# Altium schematic sheet 07-LogicXOR.SchDoc
size A4; DocumentNumber: 7; SheetNumber: 7; SheetTotal: 26
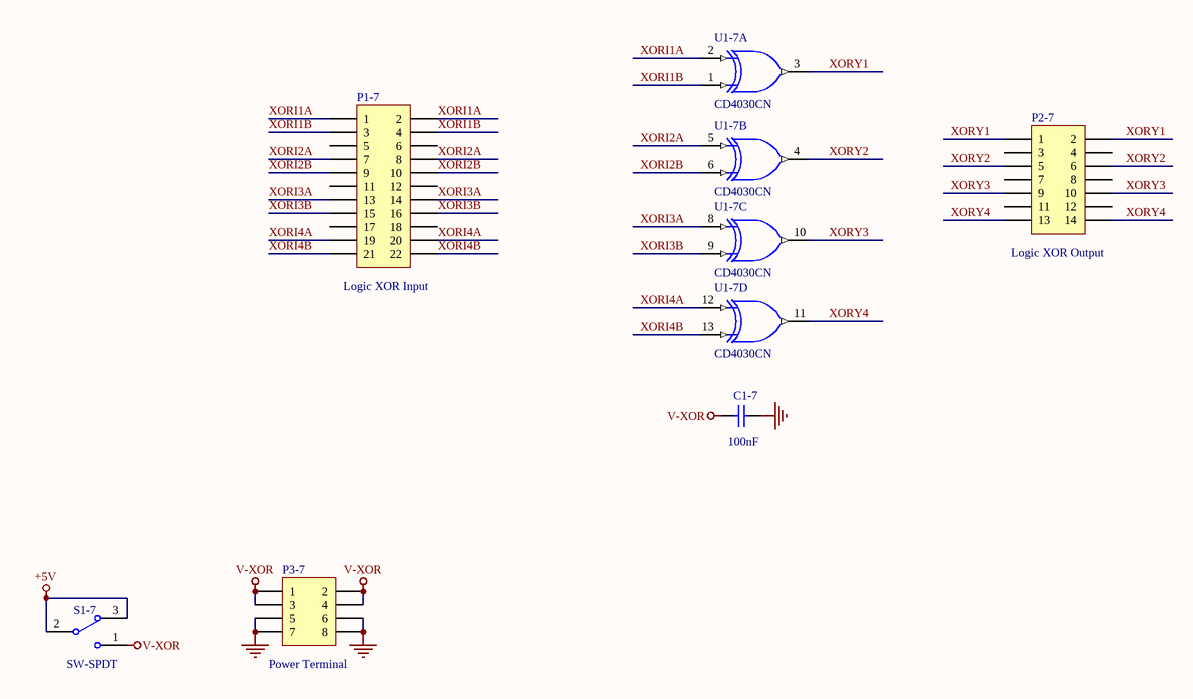
[diagram p0: 07-LogicXOR.SchDoc]

## Parts
C1-7  value 100nF  [c-0805]  (hidden comment: 104)
P1-7  value Logic XOR Input  [JP2.54-F-2x11A]  (hidden comment: Header 11X2)
P2-7  value Logic XOR Output  [JP2.54-F-2x07A]  (hidden comment: H7X2)
P3-7  Publisher: Power Terminal  [JP2.54-F-2x04A]  (hidden comment: Header 4X2)
S1-7  SW-SPDT  [SW-SLIDE-2P-2W]
U1-7  CD4030CN  [SK-DIP14-300]  (parts A,B,C,D of 4)

## Nets
+5V: S1-7.2 S1-7.3
GND: C1-7.2 P3-7.5 P3-7.6 P3-7.7 P3-7.8 U1-7.7(GND)
V-XOR: C1-7.1 P3-7.1 P3-7.2 P3-7.3 P3-7.4 S1-7.1
VDD: U1-7.14(V-XOR)
XORI1A: P1-7.1 P1-7.2 U1-7.2(A)
XORI1B: P1-7.3 P1-7.4 U1-7.1(B)
XORI2A: P1-7.7 P1-7.8 U1-7.5(A)
XORI2B: P1-7.9 P1-7.10 U1-7.6(B)
XORI3A: P1-7.13 P1-7.14 U1-7.8(A)
XORI3B: P1-7.15 P1-7.16 U1-7.9(B)
XORI4A: P1-7.19 P1-7.20 U1-7.12(A)
XORI4B: P1-7.21 P1-7.22 U1-7.13(B)
XORY1: P2-7.1 P2-7.2 U1-7.3(J)
XORY2: P2-7.5 P2-7.6 U1-7.4(J)
XORY3: P2-7.9 P2-7.10 U1-7.10(J)
XORY4: P2-7.13 P2-7.14 U1-7.11(J)

Not connected (* = marked no-connect by the designer): P1-7 5 6 11 12 17 18; P2-7 3 4 7 8 11 12

## Library data of the parts
C1-7 = Cap: Capacitor; Published: 8-Jun-2000; LatestRevisionDate: 17-Jul-2002; LatestRevisionNote: Re-released for DXP Platform.; PackageReference: RAD-0.3; Publisher: Altium Limited; PackageDescription: Radial Cap, Thru-Hole; 2 Leads; 0.3 in Pin Spacing
P1-7 = Header 11X2: Header, 11-Pin, Dual row; LatestRevisionDate: 17-Jul-2002; LatestRevisionNote: Re-released for DXP Platform.
P2-7 = Header 7X2: Header, 7-Pin, Dual row; LatestRevisionDate: 17-Jul-2002; LatestRevisionNote: Re-released for DXP Platform.
P3-7 = Header 4X2: Header, 4-Pin, Dual row; LatestRevisionDate: 17-Jul-2002; LatestRevisionNote: Re-released for DXP Platform.
S1-7 = SW-SPDT: SPDT Subminiature Toggle Switch, Right Angle Mounting, Vertical Actuation; Published: 24-Mar-1999; LatestRevisionDate: 17-Dec-2003; LatestRevisionNote: Schematic revised, PCB Footprint replaced.; DatasheetVersion: 05-Dec-2000; PackageReference: TL36WW15050; Publisher: Altium Limited; PackageDescription: Switch; 4 Leads; ComponentLink1Description: Manufacturer Link; ComponentLink1URL: http://www.apem.com
U1-7 = CD4030CN: Quad Exclusive OR Gate, 14-Pin PDIP; IC_Technology: C; Published: 17-Jul-2002; LatestRevisionDate: 29-May-2009; LatestRevisionNote: Component Body Added.; DatasheetVersion: Jan-1999; PackageVersion: 2000; PackageReference: N14A; Publisher: Altium Limited; PackageDescription: DIP, 14-Pin, Row Spacing 7.62 mm, Pitch 2.54 mm; ComponentLink1Description: Manufacturer Link; ComponentLink1URL: http://www.fairchildsemi.com/